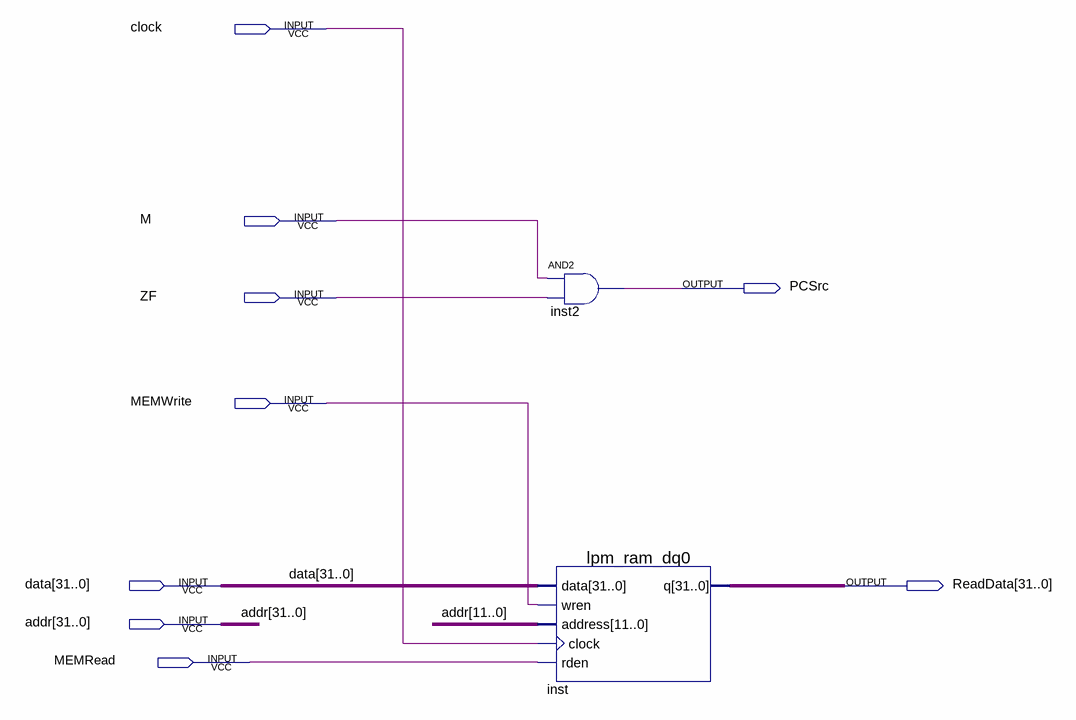
[diagram p0: schematic sheet]
// Quartus schematic MEM.bdf as structural Verilog: 2 symbols, 9 pins
module MEM (
  input  clock,
  input  M,
  input  ZF,
  input  MEMWrite,
  input  [31:0] data,
  input  [31:0] addr,
  input  MEMRead,
  output PCSrc,
  output [31:0] ReadData
);

  and inst2 (PCSrc, M, ZF);
  lpm_ram_dq0 inst (.data(data), .wren(MEMWrite), .address(addr[11:0]), .clock(clock), .rden(MEMRead), .q(ReadData));
endmodule
